# Altium schematic sheet PC104_schematic.SchDoc: PC104 Interfaces
size A2; DocumentNumber: 3; SheetNumber: 3; SheetTotal: 8
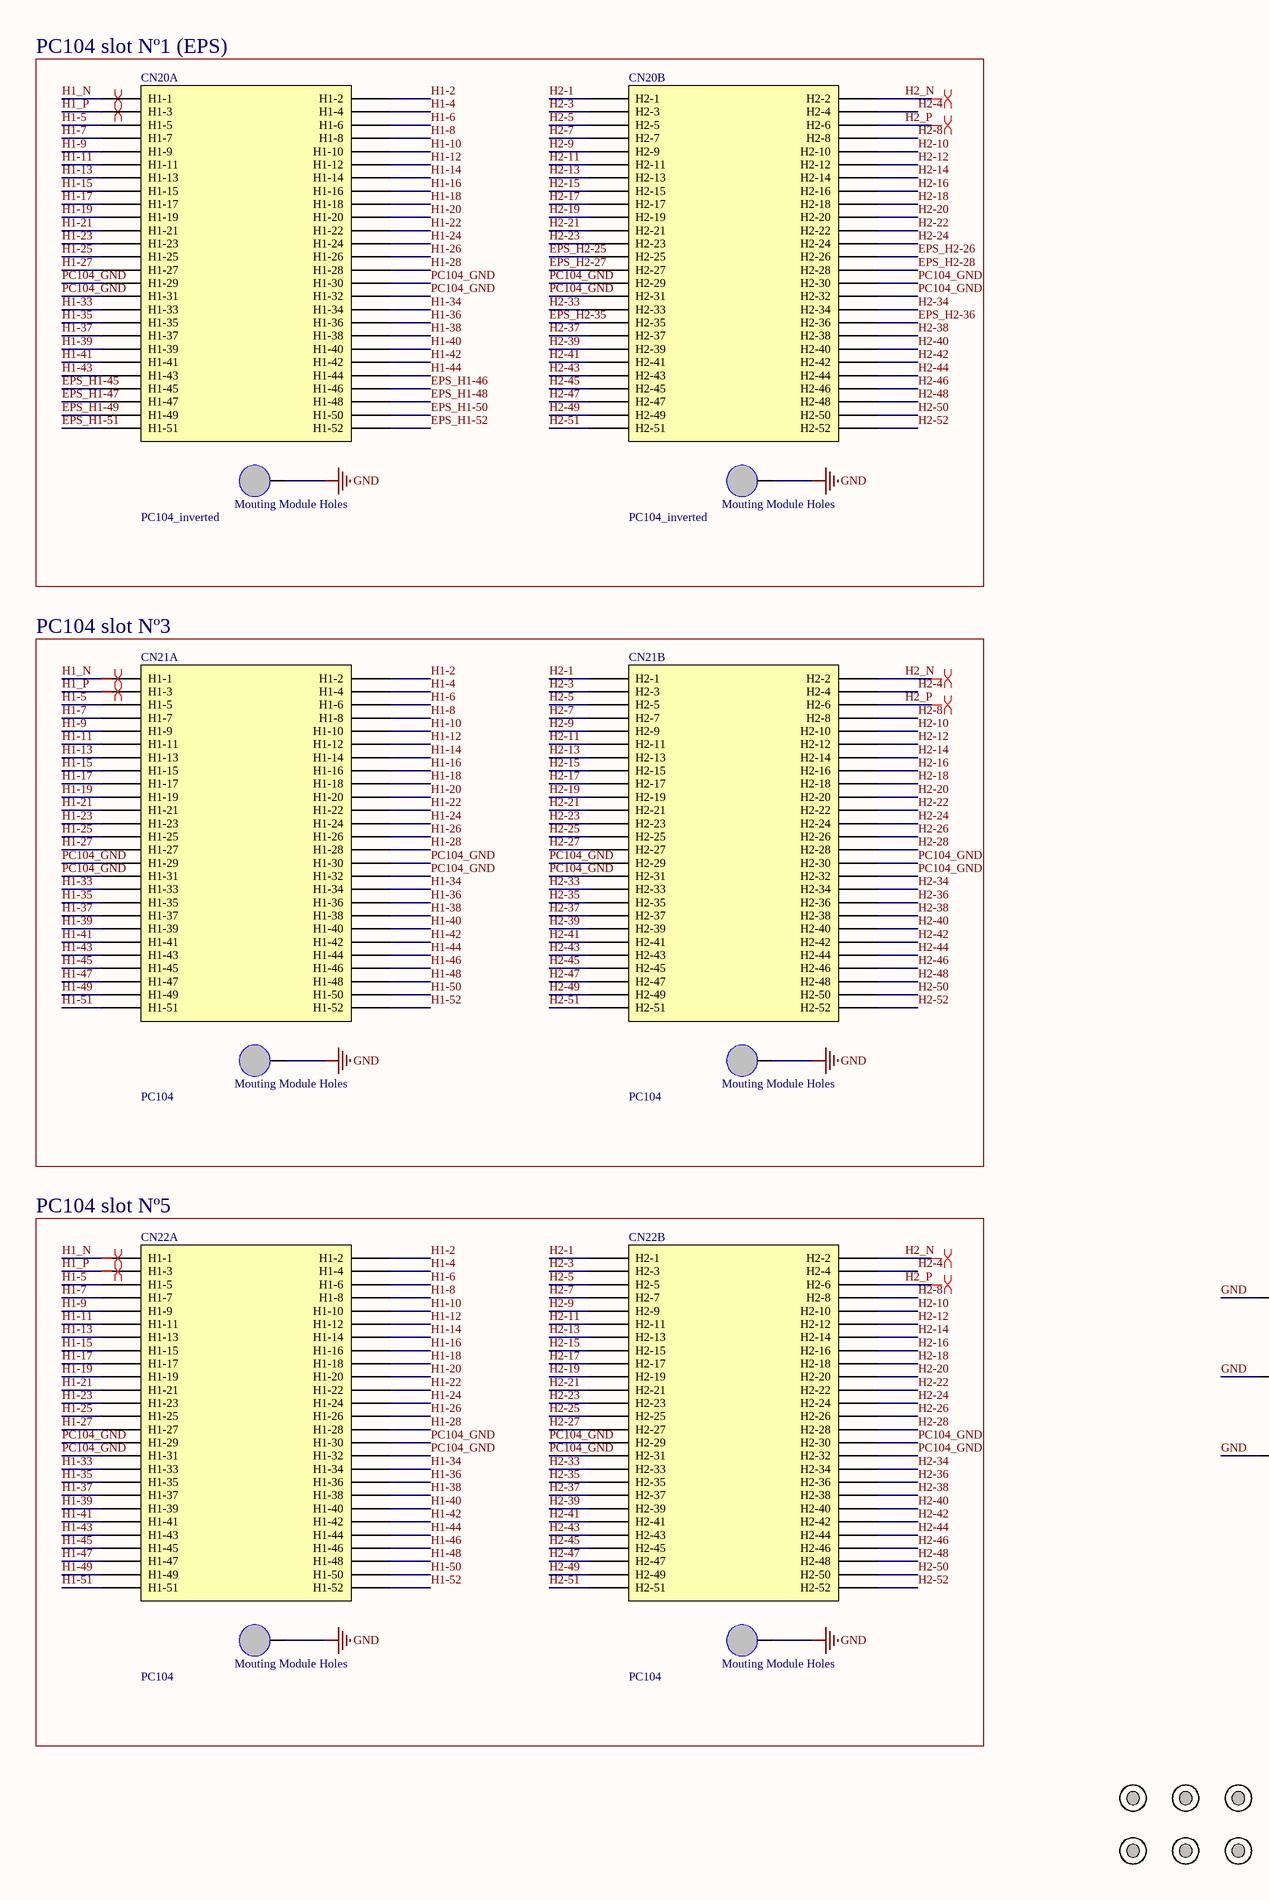
[diagram p0: PC104_schematic.SchDoc, left]
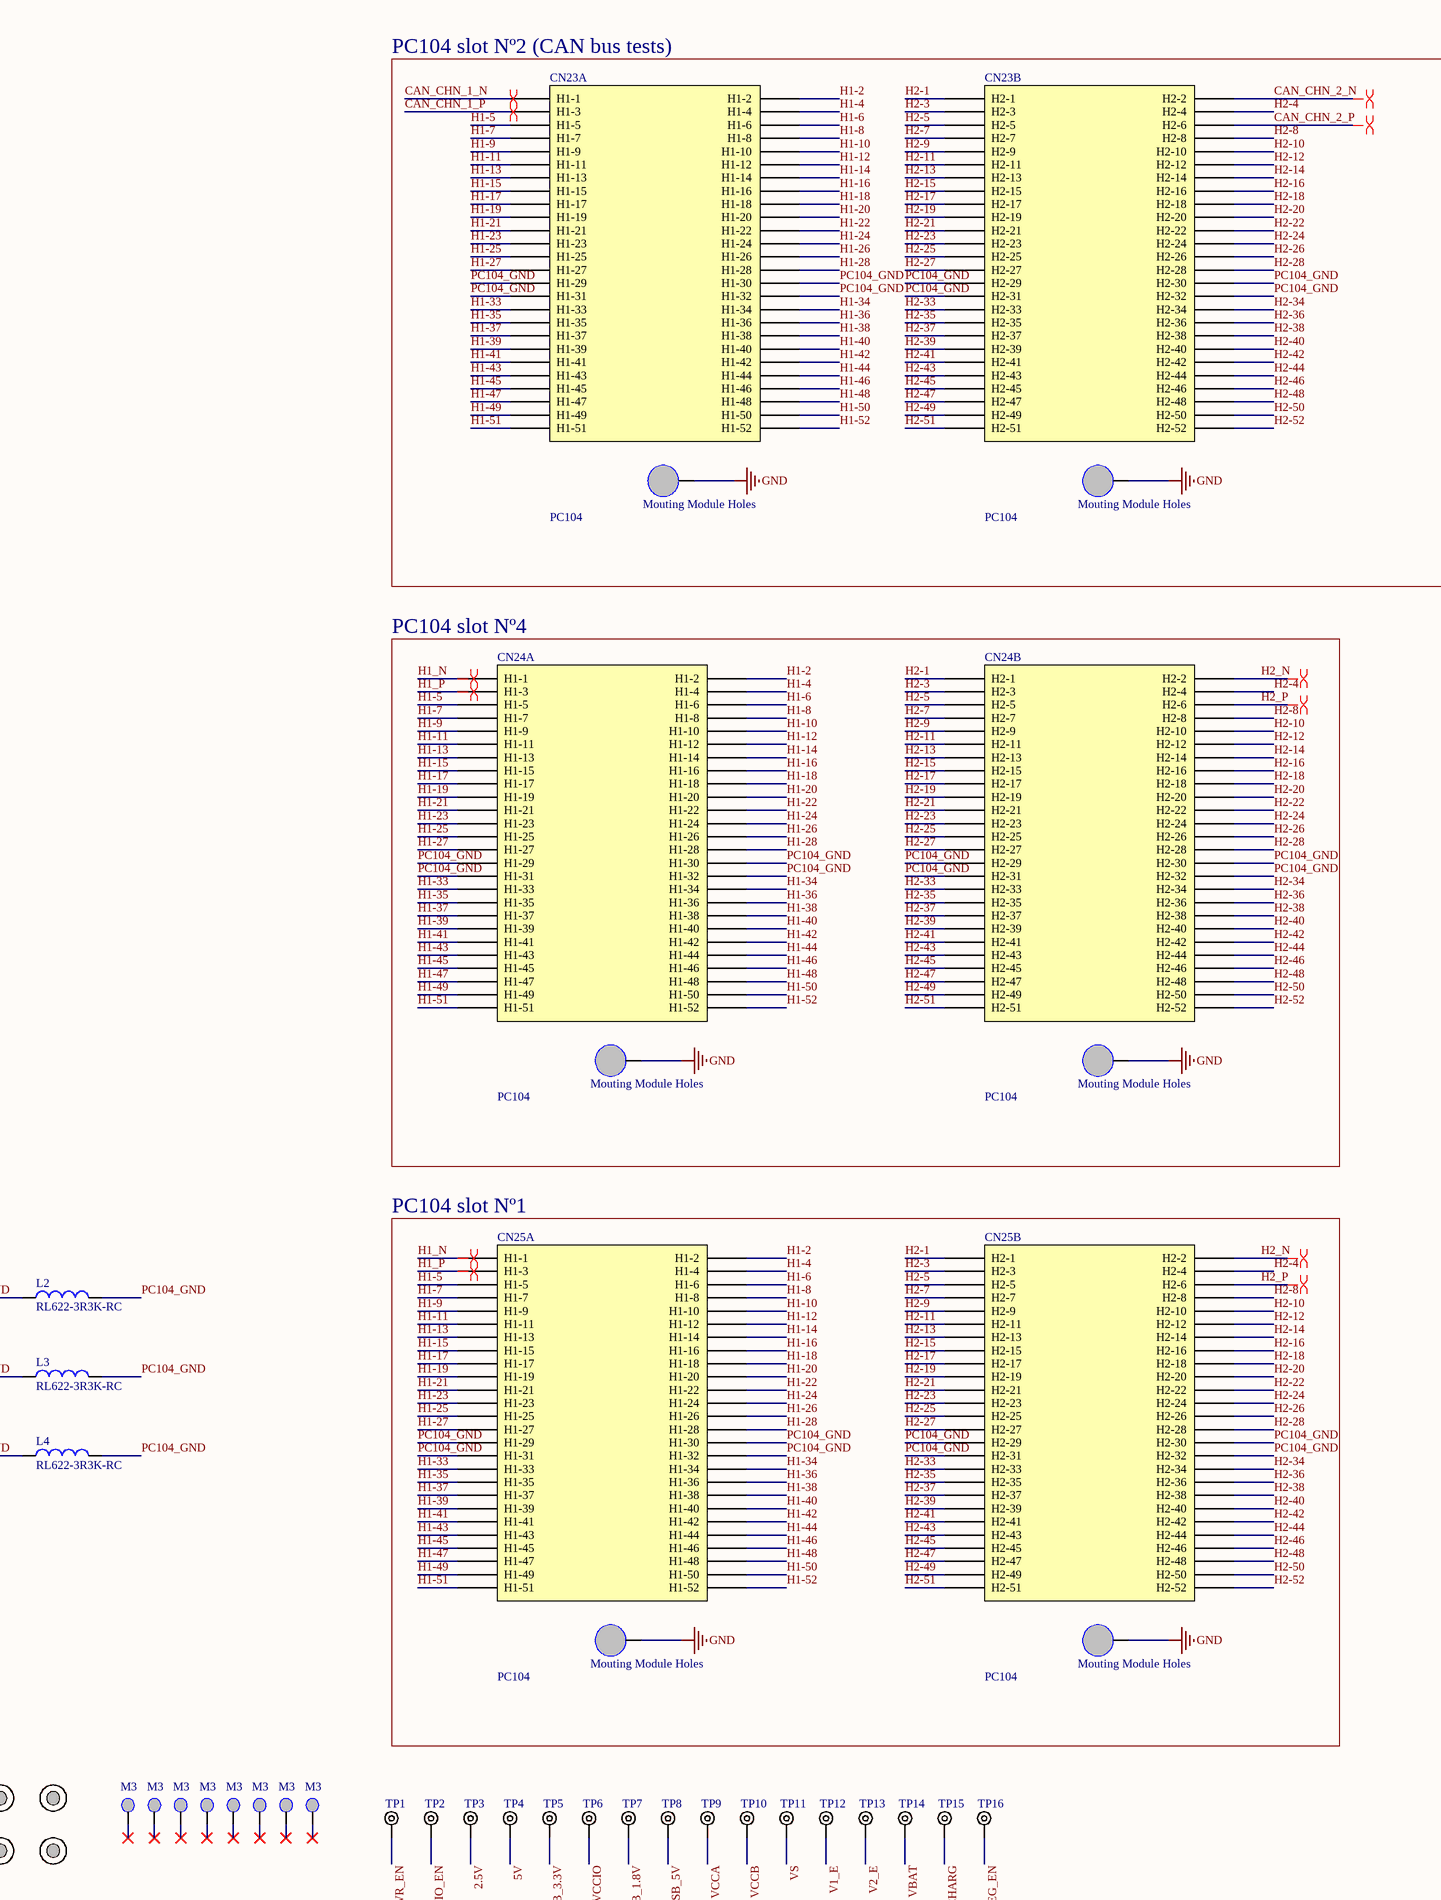
[diagram p1: PC104_schematic.SchDoc, right]

## Parts
CN20  PC104_inverted  [PC104_inverted]  (parts A,B of 2)
CN21  PC104  [PC104]  (parts A,B of 2)
CN22  PC104  [PC104]  (parts A,B of 2)
CN23  PC104  [PC104]  (parts A,B of 2)
CN24  PC104  [PC104]  (parts A,B of 2)
CN25  PC104  [PC104]  (parts A,B of 2)
FD1  Fiducial 1.3  [Fiducial 1.3mm]  (value not drawn)  (no BOM)
FD2  Fiducial 1.3  [Fiducial 1.3mm]  (value not drawn)  (no BOM)
FD3  Fiducial 1.3  [Fiducial 1.3mm]  (value not drawn)  (no BOM)
FD4  Fiducial 1.3  [Fiducial 1.3mm]  (value not drawn)  (no BOM)
FD5  Fiducial 1.3  [Fiducial 1.3mm]  (value not drawn)  (no BOM)
FD6  Fiducial 1.3  [Fiducial 1.3mm]  (value not drawn)  (no BOM)
FD7  Fiducial 1.3  [Fiducial 1.3mm]  (value not drawn)  (no BOM)
FD8  Fiducial 1.3  [Fiducial 1.3mm]  (value not drawn)  (no BOM)
L2  RL622-3R3K-RC  [RL622]
L3  RL622-3R3K-RC  [RL622]
L4  RL622-3R3K-RC  [RL622]
MEC1  M3  [M3 hole]  (no BOM)
MEC2  M3  [M3 hole]  (no BOM)
MEC3  M3  [M3 hole]  (no BOM)
MEC4  M3  [M3 hole]  (no BOM)
MEC5  M3  [M3 hole]  (no BOM)
MEC6  M3  [M3 hole]  (no BOM)
MEC7  M3  [M3 hole]  (no BOM)
MEC8  M3  [M3 hole]  (no BOM)
TP1  (no value)  [TEST POINT PTH]  (no BOM)
TP2  (no value)  [TEST POINT PTH]  (no BOM)
TP3  (no value)  [TEST POINT PTH]  (no BOM)
TP4  (no value)  [TEST POINT PTH]  (no BOM)
TP5  (no value)  [TEST POINT PTH]  (no BOM)
TP6  (no value)  [TEST POINT PTH]  (no BOM)
TP7  (no value)  [TEST POINT PTH]  (no BOM)
TP8  (no value)  [TEST POINT PTH]  (no BOM)
TP9  (no value)  [TEST POINT PTH]  (no BOM)
TP10  (no value)  [TEST POINT PTH]  (no BOM)
TP11  (no value)  [TEST POINT PTH]  (no BOM)
TP12  (no value)  [TEST POINT PTH]  (no BOM)
TP13  (no value)  [TEST POINT PTH]  (no BOM)
TP14  (no value)  [TEST POINT PTH]  (no BOM)
TP15  (no value)  [TEST POINT PTH]  (no BOM)
TP16  (no value)  [TEST POINT PTH]  (no BOM)

## Blocks framed on the sheet
PC104 slot Nº1 (EPS): CN20
PC104 slot Nº2 (CAN bus tests): CN23
PC104 slot Nº3: CN21
PC104 slot Nº4: CN24
PC104 slot Nº5: CN22
PC104 slot Nº1: CN25

## Nets
GND: CN20.0(Mouting) CN21.0(Mouting) CN22.0(Mouting) CN23.0(Mouting) CN24.0(Mouting) CN25.0(Mouting) L2.1 L3.1 L4.1
2.5V: TP3.1
5V: TP4.1
CAN_CHN_1_N: CN23.1(H1-1)
CAN_CHN_1_P: CN23.3(H1-3)
CAN_CHN_2_N: CN23.54(H2-2)
CAN_CHN_2_P: CN23.58(H2-6)
EPS_H1-45: CN20.45(H1-45)
EPS_H1-46: CN20.46(H1-46)
EPS_H1-47: CN20.47(H1-47)
EPS_H1-48: CN20.48(H1-48)
EPS_H1-49: CN20.49(H1-49)
EPS_H1-50: CN20.50(H1-50)
EPS_H1-51: CN20.51(H1-51)
EPS_H1-52: CN20.52(H1-52)
EPS_H2-25: CN20.77(H2-25)
EPS_H2-26: CN20.78(H2-26)
EPS_H2-27: CN20.79(H2-27)
EPS_H2-28: CN20.80(H2-28)
EPS_H2-35: CN20.87(H2-35)
EPS_H2-36: CN20.88(H2-36)
H1-2: CN20.2(H1-2) CN21.2(H1-2) CN22.2(H1-2) CN23.2(H1-2) CN24.2(H1-2) CN25.2(H1-2)
H1-4: CN20.4(H1-4) CN21.4(H1-4) CN22.4(H1-4) CN23.4(H1-4) CN24.4(H1-4) CN25.4(H1-4)
H1-5: CN20.5(H1-5) CN21.5(H1-5) CN22.5(H1-5) CN23.5(H1-5) CN24.5(H1-5) CN25.5(H1-5)
H1-6: CN20.6(H1-6) CN21.6(H1-6) CN22.6(H1-6) CN23.6(H1-6) CN24.6(H1-6) CN25.6(H1-6)
H1-7: CN20.7(H1-7) CN21.7(H1-7) CN22.7(H1-7) CN23.7(H1-7) CN24.7(H1-7) CN25.7(H1-7)
H1-8: CN20.8(H1-8) CN21.8(H1-8) CN22.8(H1-8) CN23.8(H1-8) CN24.8(H1-8) CN25.8(H1-8)
H1-9: CN20.9(H1-9) CN21.9(H1-9) CN22.9(H1-9) CN23.9(H1-9) CN24.9(H1-9) CN25.9(H1-9)
H1-10: CN20.10(H1-10) CN21.10(H1-10) CN22.10(H1-10) CN23.10(H1-10) CN24.10(H1-10) CN25.10(H1-10)
H1-11: CN20.11(H1-11) CN21.11(H1-11) CN22.11(H1-11) CN23.11(H1-11) CN24.11(H1-11) CN25.11(H1-11)
H1-12: CN20.12(H1-12) CN21.12(H1-12) CN22.12(H1-12) CN23.12(H1-12) CN24.12(H1-12) CN25.12(H1-12)
H1-13: CN20.13(H1-13) CN21.13(H1-13) CN22.13(H1-13) CN23.13(H1-13) CN24.13(H1-13) CN25.13(H1-13)
H1-14: CN20.14(H1-14) CN21.14(H1-14) CN22.14(H1-14) CN23.14(H1-14) CN24.14(H1-14) CN25.14(H1-14)
H1-15: CN20.15(H1-15) CN21.15(H1-15) CN22.15(H1-15) CN23.15(H1-15) CN24.15(H1-15) CN25.15(H1-15)
H1-16: CN20.16(H1-16) CN21.16(H1-16) CN22.16(H1-16) CN23.16(H1-16) CN24.16(H1-16) CN25.16(H1-16)
H1-17: CN20.17(H1-17) CN21.17(H1-17) CN22.17(H1-17) CN23.17(H1-17) CN24.17(H1-17) CN25.17(H1-17)
H1-18: CN20.18(H1-18) CN21.18(H1-18) CN22.18(H1-18) CN23.18(H1-18) CN24.18(H1-18) CN25.18(H1-18)
H1-19: CN20.19(H1-19) CN21.19(H1-19) CN22.19(H1-19) CN23.19(H1-19) CN24.19(H1-19) CN25.19(H1-19)
H1-20: CN20.20(H1-20) CN21.20(H1-20) CN22.20(H1-20) CN23.20(H1-20) CN24.20(H1-20) CN25.20(H1-20)
H1-21: CN20.21(H1-21) CN21.21(H1-21) CN22.21(H1-21) CN23.21(H1-21) CN24.21(H1-21) CN25.21(H1-21)
H1-22: CN20.22(H1-22) CN21.22(H1-22) CN22.22(H1-22) CN23.22(H1-22) CN24.22(H1-22) CN25.22(H1-22)
H1-23: CN20.23(H1-23) CN21.23(H1-23) CN22.23(H1-23) CN23.23(H1-23) CN24.23(H1-23) CN25.23(H1-23)
H1-24: CN20.24(H1-24) CN21.24(H1-24) CN22.24(H1-24) CN23.24(H1-24) CN24.24(H1-24) CN25.24(H1-24)
H1-25: CN20.25(H1-25) CN21.25(H1-25) CN22.25(H1-25) CN23.25(H1-25) CN24.25(H1-25) CN25.25(H1-25)
H1-26: CN20.26(H1-26) CN21.26(H1-26) CN22.26(H1-26) CN23.26(H1-26) CN24.26(H1-26) CN25.26(H1-26)
H1-27: CN20.27(H1-27) CN21.27(H1-27) CN22.27(H1-27) CN23.27(H1-27) CN24.27(H1-27) CN25.27(H1-27)
H1-28: CN20.28(H1-28) CN21.28(H1-28) CN22.28(H1-28) CN23.28(H1-28) CN24.28(H1-28) CN25.28(H1-28)
H1-33: CN20.33(H1-33) CN21.33(H1-33) CN22.33(H1-33) CN23.33(H1-33) CN24.33(H1-33) CN25.33(H1-33)
H1-34: CN20.34(H1-34) CN21.34(H1-34) CN22.34(H1-34) CN23.34(H1-34) CN24.34(H1-34) CN25.34(H1-34)
H1-35: CN20.35(H1-35) CN21.35(H1-35) CN22.35(H1-35) CN23.35(H1-35) CN24.35(H1-35) CN25.35(H1-35)
H1-36: CN20.36(H1-36) CN21.36(H1-36) CN22.36(H1-36) CN23.36(H1-36) CN24.36(H1-36) CN25.36(H1-36)
H1-37: CN20.37(H1-37) CN21.37(H1-37) CN22.37(H1-37) CN23.37(H1-37) CN24.37(H1-37) CN25.37(H1-37)
H1-38: CN20.38(H1-38) CN21.38(H1-38) CN22.38(H1-38) CN23.38(H1-38) CN24.38(H1-38) CN25.38(H1-38)
H1-39: CN20.39(H1-39) CN21.39(H1-39) CN22.39(H1-39) CN23.39(H1-39) CN24.39(H1-39) CN25.39(H1-39)
H1-40: CN20.40(H1-40) CN21.40(H1-40) CN22.40(H1-40) CN23.40(H1-40) CN24.40(H1-40) CN25.40(H1-40)
H1-41: CN20.41(H1-41) CN21.41(H1-41) CN22.41(H1-41) CN23.41(H1-41) CN24.41(H1-41) CN25.41(H1-41)
H1-42: CN20.42(H1-42) CN21.42(H1-42) CN22.42(H1-42) CN23.42(H1-42) CN24.42(H1-42) CN25.42(H1-42)
H1-43: CN20.43(H1-43) CN21.43(H1-43) CN22.43(H1-43) CN23.43(H1-43) CN24.43(H1-43) CN25.43(H1-43)
H1-44: CN20.44(H1-44) CN21.44(H1-44) CN22.44(H1-44) CN23.44(H1-44) CN24.44(H1-44) CN25.44(H1-44)
H1-45: CN21.45(H1-45) CN22.45(H1-45) CN23.45(H1-45) CN24.45(H1-45) CN25.45(H1-45)
H1-46: CN21.46(H1-46) CN22.46(H1-46) CN23.46(H1-46) CN24.46(H1-46) CN25.46(H1-46)
H1-47: CN21.47(H1-47) CN22.47(H1-47) CN23.47(H1-47) CN24.47(H1-47) CN25.47(H1-47)
H1-48: CN21.48(H1-48) CN22.48(H1-48) CN23.48(H1-48) CN24.48(H1-48) CN25.48(H1-48)
H1-49: CN21.49(H1-49) CN22.49(H1-49) CN23.49(H1-49) CN24.49(H1-49) CN25.49(H1-49)
H1-50: CN21.50(H1-50) CN22.50(H1-50) CN23.50(H1-50) CN24.50(H1-50) CN25.50(H1-50)
H1-51: CN21.51(H1-51) CN22.51(H1-51) CN23.51(H1-51) CN24.51(H1-51) CN25.51(H1-51)
H1-52: CN21.52(H1-52) CN22.52(H1-52) CN23.52(H1-52) CN24.52(H1-52) CN25.52(H1-52)
H1_N: CN20.1(H1-1) CN21.1(H1-1) CN22.1(H1-1) CN24.1(H1-1) CN25.1(H1-1)
H1_P: CN20.3(H1-3) CN21.3(H1-3) CN22.3(H1-3) CN24.3(H1-3) CN25.3(H1-3)
H2-1: CN20.53(H2-1) CN21.53(H2-1) CN22.53(H2-1) CN23.53(H2-1) CN24.53(H2-1) CN25.53(H2-1)
H2-3: CN20.55(H2-3) CN21.55(H2-3) CN22.55(H2-3) CN23.55(H2-3) CN24.55(H2-3) CN25.55(H2-3)
H2-4: CN20.56(H2-4) CN21.56(H2-4) CN22.56(H2-4) CN23.56(H2-4) CN24.56(H2-4) CN25.56(H2-4)
H2-5: CN20.57(H2-5) CN21.57(H2-5) CN22.57(H2-5) CN23.57(H2-5) CN24.57(H2-5) CN25.57(H2-5)
H2-7: CN20.59(H2-7) CN21.59(H2-7) CN22.59(H2-7) CN23.59(H2-7) CN24.59(H2-7) CN25.59(H2-7)
H2-8: CN20.60(H2-8) CN21.60(H2-8) CN22.60(H2-8) CN23.60(H2-8) CN24.60(H2-8) CN25.60(H2-8)
H2-9: CN20.61(H2-9) CN21.61(H2-9) CN22.61(H2-9) CN23.61(H2-9) CN24.61(H2-9) CN25.61(H2-9)
H2-10: CN20.62(H2-10) CN21.62(H2-10) CN22.62(H2-10) CN23.62(H2-10) CN24.62(H2-10) CN25.62(H2-10)
H2-11: CN20.63(H2-11) CN21.63(H2-11) CN22.63(H2-11) CN23.63(H2-11) CN24.63(H2-11) CN25.63(H2-11)
H2-12: CN20.64(H2-12) CN21.64(H2-12) CN22.64(H2-12) CN23.64(H2-12) CN24.64(H2-12) CN25.64(H2-12)
H2-13: CN20.65(H2-13) CN21.65(H2-13) CN22.65(H2-13) CN23.65(H2-13) CN24.65(H2-13) CN25.65(H2-13)
H2-14: CN20.66(H2-14) CN21.66(H2-14) CN22.66(H2-14) CN23.66(H2-14) CN24.66(H2-14) CN25.66(H2-14)
H2-15: CN20.67(H2-15) CN21.67(H2-15) CN22.67(H2-15) CN23.67(H2-15) CN24.67(H2-15) CN25.67(H2-15)
H2-16: CN20.68(H2-16) CN21.68(H2-16) CN22.68(H2-16) CN23.68(H2-16) CN24.68(H2-16) CN25.68(H2-16)
H2-17: CN20.69(H2-17) CN21.69(H2-17) CN22.69(H2-17) CN23.69(H2-17) CN24.69(H2-17) CN25.69(H2-17)
H2-18: CN20.70(H2-18) CN21.70(H2-18) CN22.70(H2-18) CN23.70(H2-18) CN24.70(H2-18) CN25.70(H2-18)
H2-19: CN20.71(H2-19) CN21.71(H2-19) CN22.71(H2-19) CN23.71(H2-19) CN24.71(H2-19) CN25.71(H2-19)
H2-20: CN20.72(H2-20) CN21.72(H2-20) CN22.72(H2-20) CN23.72(H2-20) CN24.72(H2-20) CN25.72(H2-20)
H2-21: CN20.73(H2-21) CN21.73(H2-21) CN22.73(H2-21) CN23.73(H2-21) CN24.73(H2-21) CN25.73(H2-21)
H2-22: CN20.74(H2-22) CN21.74(H2-22) CN22.74(H2-22) CN23.74(H2-22) CN24.74(H2-22) CN25.74(H2-22)
H2-23: CN20.75(H2-23) CN21.75(H2-23) CN22.75(H2-23) CN23.75(H2-23) CN24.75(H2-23) CN25.75(H2-23)
H2-24: CN20.76(H2-24) CN21.76(H2-24) CN22.76(H2-24) CN23.76(H2-24) CN24.76(H2-24) CN25.76(H2-24)
H2-25: CN21.77(H2-25) CN22.77(H2-25) CN23.77(H2-25) CN24.77(H2-25) CN25.77(H2-25)
H2-26: CN21.78(H2-26) CN22.78(H2-26) CN23.78(H2-26) CN24.78(H2-26) CN25.78(H2-26)
H2-27: CN21.79(H2-27) CN22.79(H2-27) CN23.79(H2-27) CN24.79(H2-27) CN25.79(H2-27)
H2-28: CN21.80(H2-28) CN22.80(H2-28) CN23.80(H2-28) CN24.80(H2-28) CN25.80(H2-28)
H2-33: CN20.85(H2-33) CN21.85(H2-33) CN22.85(H2-33) CN23.85(H2-33) CN24.85(H2-33) CN25.85(H2-33)
H2-34: CN20.86(H2-34) CN21.86(H2-34) CN22.86(H2-34) CN23.86(H2-34) CN24.86(H2-34) CN25.86(H2-34)
H2-35: CN21.87(H2-35) CN22.87(H2-35) CN23.87(H2-35) CN24.87(H2-35) CN25.87(H2-35)
H2-36: CN21.88(H2-36) CN22.88(H2-36) CN23.88(H2-36) CN24.88(H2-36) CN25.88(H2-36)
H2-37: CN20.89(H2-37) CN21.89(H2-37) CN22.89(H2-37) CN23.89(H2-37) CN24.89(H2-37) CN25.89(H2-37)
H2-38: CN20.90(H2-38) CN21.90(H2-38) CN22.90(H2-38) CN23.90(H2-38) CN24.90(H2-38) CN25.90(H2-38)
H2-39: CN20.91(H2-39) CN21.91(H2-39) CN22.91(H2-39) CN23.91(H2-39) CN24.91(H2-39) CN25.91(H2-39)
H2-40: CN20.92(H2-40) CN21.92(H2-40) CN22.92(H2-40) CN23.92(H2-40) CN24.92(H2-40) CN25.92(H2-40)
H2-41: CN20.93(H2-41) CN21.93(H2-41) CN22.93(H2-41) CN23.93(H2-41) CN24.93(H2-41) CN25.93(H2-41)
H2-42: CN20.94(H2-42) CN21.94(H2-42) CN22.94(H2-42) CN23.94(H2-42) CN24.94(H2-42) CN25.94(H2-42)
H2-43: CN20.95(H2-43) CN21.95(H2-43) CN22.95(H2-43) CN23.95(H2-43) CN24.95(H2-43) CN25.95(H2-43)
H2-44: CN20.96(H2-44) CN21.96(H2-44) CN22.96(H2-44) CN23.96(H2-44) CN24.96(H2-44) CN25.96(H2-44)
H2-45: CN20.97(H2-45) CN21.97(H2-45) CN22.97(H2-45) CN23.97(H2-45) CN24.97(H2-45) CN25.97(H2-45)
H2-46: CN20.98(H2-46) CN21.98(H2-46) CN22.98(H2-46) CN23.98(H2-46) CN24.98(H2-46) CN25.98(H2-46)
H2-47: CN20.99(H2-47) CN21.99(H2-47) CN22.99(H2-47) CN23.99(H2-47) CN24.99(H2-47) CN25.99(H2-47)
H2-48: CN20.100(H2-48) CN21.100(H2-48) CN22.100(H2-48) CN23.100(H2-48) CN24.100(H2-48) CN25.100(H2-48)
H2-49: CN20.101(H2-49) CN21.101(H2-49) CN22.101(H2-49) CN23.101(H2-49) CN24.101(H2-49) CN25.101(H2-49)
H2-50: CN20.102(H2-50) CN21.102(H2-50) CN22.102(H2-50) CN23.102(H2-50) CN24.102(H2-50) CN25.102(H2-50)
H2-51: CN20.103(H2-51) CN21.103(H2-51) CN22.103(H2-51) CN23.103(H2-51) CN24.103(H2-51) CN25.103(H2-51)
H2-52: CN20.104(H2-52) CN21.104(H2-52) CN22.104(H2-52) CN23.104(H2-52) CN24.104(H2-52) CN25.104(H2-52)
H2_N: CN20.54(H2-2) CN21.54(H2-2) CN22.54(H2-2) CN24.54(H2-2) CN25.54(H2-2)
H2_P: CN20.58(H2-6) CN21.58(H2-6) CN22.58(H2-6) CN24.58(H2-6) CN25.58(H2-6)
PC104_GND: CN20.29(H1-29) CN20.30(H1-30) CN20.31(H1-31) CN20.32(H1-32) CN20.81(H2-29) CN20.82(H2-30) CN20.83(H2-31) CN20.84(H2-32) CN21.29(H1-29) CN21.30(H1-30) CN21.31(H1-31) CN21.32(H1-32) CN21.81(H2-29) CN21.82(H2-30) CN21.83(H2-31) CN21.84(H2-32) CN22.29(H1-29) CN22.30(H1-30) CN22.31(H1-31) CN22.32(H1-32) CN22.81(H2-29) CN22.82(H2-30) CN22.83(H2-31) CN22.84(H2-32) CN23.29(H1-29) CN23.30(H1-30) CN23.31(H1-31) CN23.32(H1-32) CN23.81(H2-29) CN23.82(H2-30) CN23.83(H2-31) CN23.84(H2-32) CN24.29(H1-29) CN24.30(H1-30) CN24.31(H1-31) CN24.32(H1-32) CN24.81(H2-29) CN24.82(H2-30) CN24.83(H2-31) CN24.84(H2-32) CN25.29(H1-29) CN25.30(H1-30) CN25.31(H1-31) CN25.32(H1-32) CN25.81(H2-29) CN25.82(H2-30) CN25.83(H2-31) CN25.84(H2-32) L2.2 L3.2 L4.2
PWR_EN: TP1.1
REG_EN: TP16.1
USB_1.8V: TP7.1
USB_3.3V: TP5.1
USB_5V: TP8.1
V1_E: TP12.1
V2_E: TP13.1
VBAT: TP14.1
VCCA: TP9.1
VCCB: TP10.1
VCCIO: TP6.1
VCCIO_EN: TP2.1
VCHARG: TP15.1
VS: TP11.1

Not connected (* = marked no-connect by the designer): MEC1 0*; MEC2 0*; MEC3 0*; MEC4 0*; MEC5 0*; MEC6 0*; MEC7 0*; MEC8 0*

## Layout directives
differential pair: CAN_CHN_1_N, CAN_CHN_1_P, CAN_CHN_2_N, CAN_CHN_2_P, H1_N, H1_P, H2_N, H2_P

## Notes on the sheet
- Title:
- Project:
- SpaceLab - Federal University of Santa Catarina
- Date:
- Engineer:
- Revision:
- Sheet
- of
- Project Code:
- Size:
- A2
- (in symbol PC104, part A) Mouting Module Holes
- (in symbol PC104, part B) Mouting Module Holes
- (in symbol PC104_inverted, part A) Mouting Module Holes
- (in symbol PC104_inverted, part B) Mouting Module Holes

## Library data of the parts
CN20 = PC104_inverted: Manufacturer Part Number: TSW-126-07-G-D
CN21-CN25 = PC104: Manufacturer Part Number: SSW-126-01-G-D
FD1-FD8 = Fiducial 1.3: Fiducial 1.3mm
L2-L4 = RL622-3R3K-RC: 3.3ÂµH Unshielded Wirewound Inductor 5.5A 25mOhm Max Radial, Vertical Cylinder; MF: Bourns; Price: None; Value: *; Package: Radial Bourns - J.W. Miller; Purchase-URL: https://pricing.snapeda.com/search/part/RL622-3R3K-RC/?ref=eda; SnapEDA_Link: https://www.snapeda.com/parts/RL622-3R3K-RC/Bourns/view-part/337281/?ref=snap; Check_prices: https://www.snapeda.com/parts/RL622-3R3K-RC/Bourns/view-part/337281/?ref=eda; Availability: Good; Manufacturer Part Number: RL622-3R3K-RC
MEC1-MEC8 = M3 hole
TP1-TP16 = Test Point PTH: TEST POINT PAD